# EAGLE design kulgurpowerproto (EAGLE 6.3)
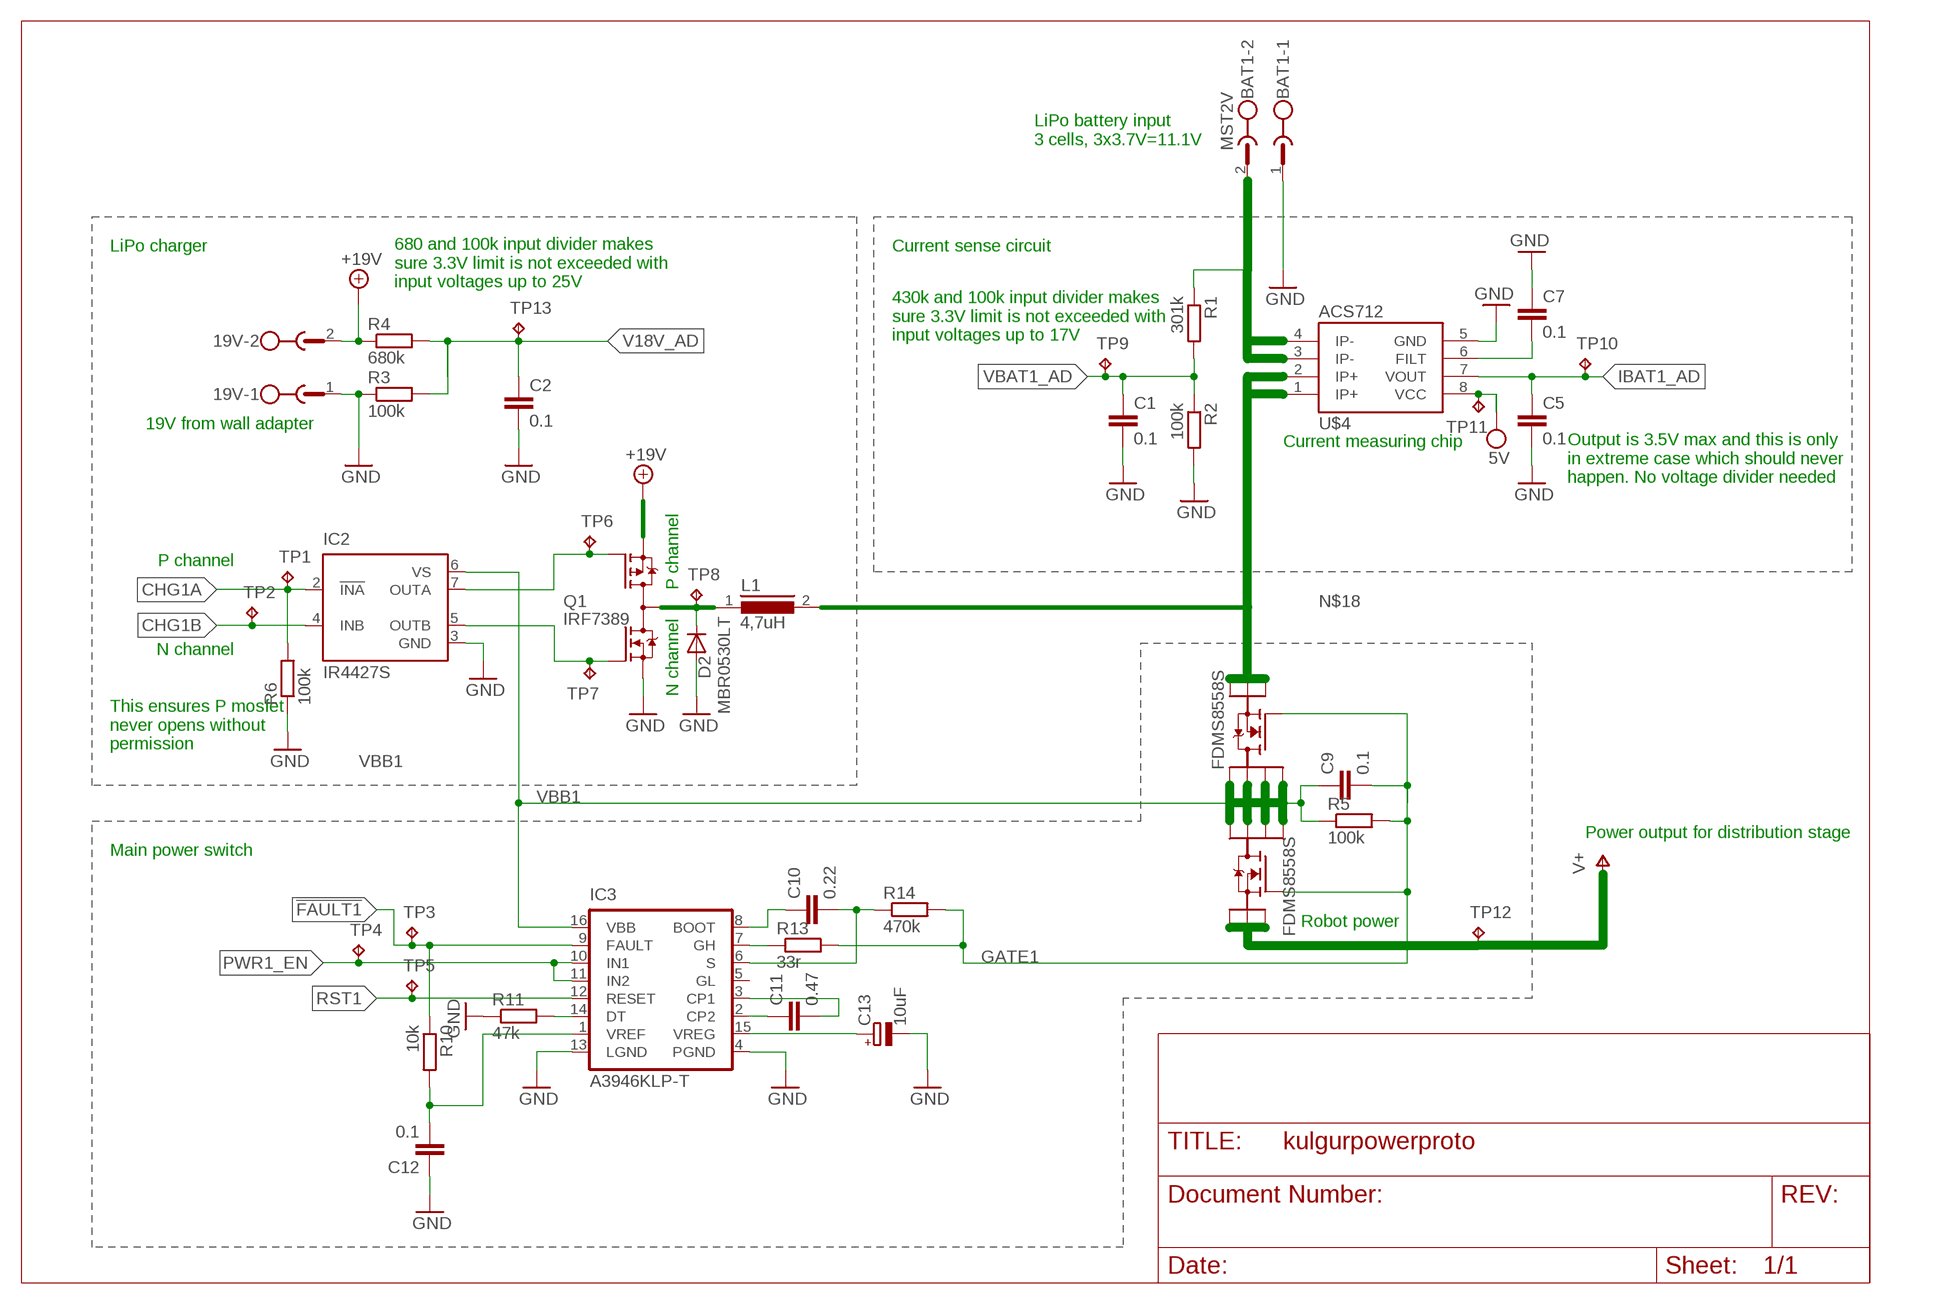
[diagram p0: schematic, sheet 1]

## Parts
19V  MST2V  [MSTBV2]
BAT1  MST2V  [MSTBV2]
C1  0.1  C-EUC0603  [C0603]
C2  0.1  C-EUC0603  [C0603]
C5  0.1  C-EUC0603  [C0603]
C7  0.1  C-EUC0603  [C0603]
C9  0.1  C-EUC0603  [C0603]
C10  0.22  C-EUC0603  [C0603]
C11  0.47  C-EUC0603  [C0603]
C12  0.1  C-EUC0603  [C0603]
C13  10uF  CPOL-EUA/3216-18R  [A/3216-18R]
D2  MBR0530LT  MBR0520LT  [SOD123]
IC2  IR4427S  IR4428S  [SO08]
IC3  A3946KLP-T  [TSSOP16E]
L1  4,7uH  DR73  [DR73]
Q1  IRF7389  [SO08-IRF]
R1  301k  R-EU_R0603  [R0603]
R2  100k  R-EU_R0603  [R0603]
R3  100k  R-EU_R0603  [R0603]
R4  680k  R-EU_R0603  [R0603]
R5  100k  R-EU_R0603  [R0603]
R6  100k  R-EU_R0603  [R0603]
R10  10k  R-EU_R0603  [R0603]
R11  47k  R-EU_R0603  [R0603]
R13  33r  R-EU_R0603  [R0603]
R14  470k  R-EU_R0603  [R0603]
TP1  TPB2,54  [B2,54]
TP2  TPB2,54  [B2,54]
TP3  TPB2,54  [B2,54]
TP4  TPB2,54  [B2,54]
TP5  TPB2,54  [B2,54]
TP6  TPB2,54  [B2,54]
TP7  TPB2,54  [B2,54]
TP8  TPB2,54  [B2,54]
TP9  TPB2,54  [B2,54]
TP10  TPB2,54  [B2,54]
TP11  TPB2,54  [B2,54]
TP12  TPB2,54  [B2,54]
TP13  TPB2,54  [B2,54]
U$2  FDMS8558S  [POWER56]
U$3  FDMS8558S  [POWER56]
U$4  ACS712  [SO08]

## Nets
5V [morepower]: TP11.TP U$4.8(VCC)
!FAULT1: IC3.9(FAULT) R10.1 TP3.TP
+19V [morepower]: 19V.2 Q1.3(P-S) R4.1
CHG1A: IC2.2(!INA) R6.2 TP1.TP
CHG1B: IC2.4(INB) TP2.TP
GATE1: C9.2 R5.2 R13.2 R14.2 U$2.P$4(G) U$3.P$4(G)
GND [morepower]: 19V.1 BAT1.1 C1.2 C2.2 C5.2 C7.1 C12.1 C13.- D2.A IC2.3(GND) IC3.4(PGND) IC3.13(LGND) Q1.1(N-S) R2.2 R3.1 R6.1 R11.1 U$4.5(GND)
IBAT1_AD: C5.1 TP10.TP U$4.7(VOUT)
N$1: IC2.7(OUTA) Q1.4(P-G) TP6.TP
N$3: IC2.5(OUTB) Q1.2(N-G) TP7.TP
N$15 [morepower]: D2.C L1.1 Q1.5(D) Q1.6(D) Q1.7(D) Q1.8(D) TP8.TP
N$17: C10.1 IC3.8(BOOT)
N$18 [morepower]: L1.2 U$2.P$1(S1) U$2.P$2(S2) U$2.P$3(S3) U$4.1(IP+) U$4.2(IP+)
N$20: C10.2 IC3.6(S) R14.1
N$21: C7.2 U$4.6(FILT)
N$24 [morepower]: BAT1.2 R1.1 U$4.3(IP-) U$4.4(IP-)
N$27: C11.1 IC3.2(CP2)
N$28: C11.2 IC3.3(CP1)
N$30: C12.2 IC3.1(VREF) R10.2
N$31: IC3.7(GH) R13.1
N$32: IC3.14(DT) R11.2
N$33: C13.+ IC3.15(VREG)
PWR1_EN: IC3.10(IN1) IC3.11(IN2) TP4.TP
RST1: IC3.12(RESET) TP5.TP
V18V_AD: C2.1 R3.2 R4.2 TP13.TP
V+ [morepower]: TP12.TP U$3.P$1(S1) U$3.P$2(S2) U$3.P$3(S3)
VBAT1_AD: C1.1 R1.2 R2.1 TP9.TP
VBB1 [morepower]: C9.1 IC2.6(VS) IC3.16(VBB) R5.1 U$2.P$5(D4) U$2.P$6(D3) U$2.P$7(D2) U$2.P$8(D1) U$3.P$5(D4) U$3.P$6(D3) U$3.P$7(D2) U$3.P$8(D1)
Unconnected: IC3.5(GL)

## Notes on the sheet
- LiPo battery input
  3 cells, 3x3.7V=11.1V
- LiPo charger | Current sense circuit
- 680 and 100k input divider makes
  sure 3.3V limit is not exceeded with 
  input voltages up to 25V
- 430k and 100k input divider makes
  sure 3.3V limit is not exceeded with 
  input voltages up to 17V
- 19V from wall adapter
- Current measuring chip
- Output is 3.5V max and this is only
  in extreme case which should never 
  happen. No voltage divider needed
- P channel
- P channel
- N channel
- N channel
- This ensures P mosfet
  never opens without 
  permission
- Power output for distribution stage
- Main power switch
- Robot power

## Library data of the parts
19V BAT1 = con-phoenix-508:MST2V: PHOENIX; OC_FARNELL: unknown; OC_NEWARK: unknown
C1 C2 C5 C7 = rcl:C-EU: CAPACITOR, European symbol
C9-C12 = resistor:C-EU: CAPACITOR, European symbol
C13 = resistor:CPOL-EU: POLARIZED CAPACITOR, European symbol
D2 = diode:MBR0520LT: SCHOTTKY BARRIER RECTIFIER Source: http://onsemi.com .. MBR0520LT1-D.pdf
IC2 = ir:IR4428: DUAL LOW SIDE DRIVER Source: ID4426.pdf; MF: INTERNATIONAL RECTIFIER(IR); MPN: IR4428STR; OC_FARNELL: 1023269; OC_NEWARK: 30C0206
IC3 = allegro:A3946: Half-Bridge Power MOSFET Controller Source: Data sheet <http://www.allegromicro.com/Products/Motor-Driver-And-Interface-ICs/Brushless-DC-Motor-Drivers/A3946.aspx>
L1 = inductors:DR73: High Power Density, High Efficiency, Shielded Inductors Source: coiltronics_dr_series.pdf
Q1 = transistor-fet:IRF7389: Complimentary Half Bridge HEXFET Power MOSFET Source: http://www.irf.com/product-info/datasheets/data/irf7389.pdf
R1-R6 R10 R11 R13 R14 = rcl:R-EU_: RESISTOR, European symbol
TP1-TP13 = testpad:TP: Test pad
U$2 U$3 = FDMS8558S:FDMS8558S
U$4 = SparkFun-AnalogIC:ACS712: Hall-effect-based isolated linear current sensor

## Net classes
0 default: width 0.4 mm, drill 0.5 mm, clearance 0.203 mm
1 power: width 1 mm, drill 0.5 mm, clearance 0.203 mm
2 morepower: width 2 mm, drill 1 mm, clearance 0.203 mm

## Board
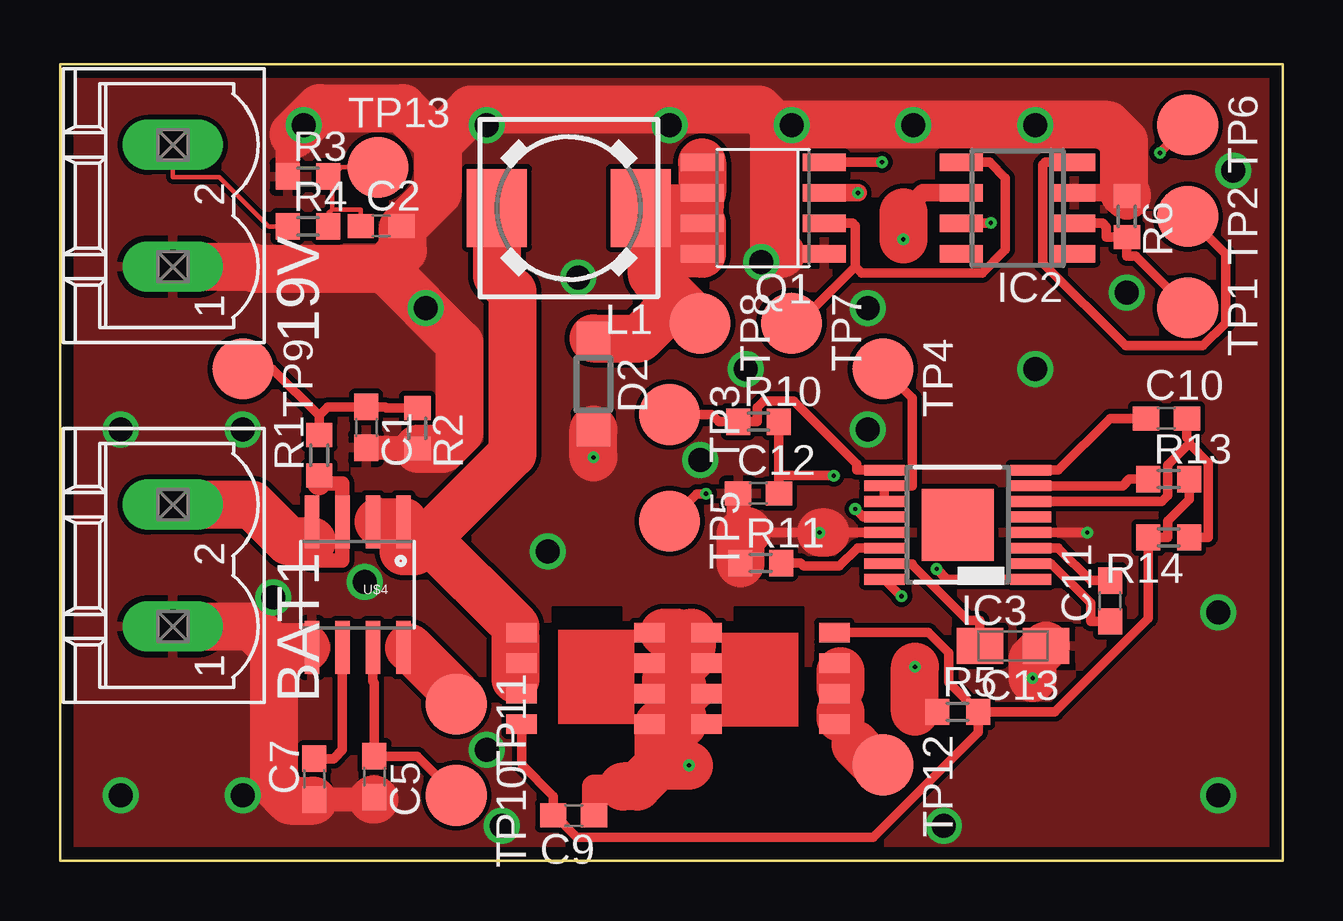
[diagram p1: board, top side]
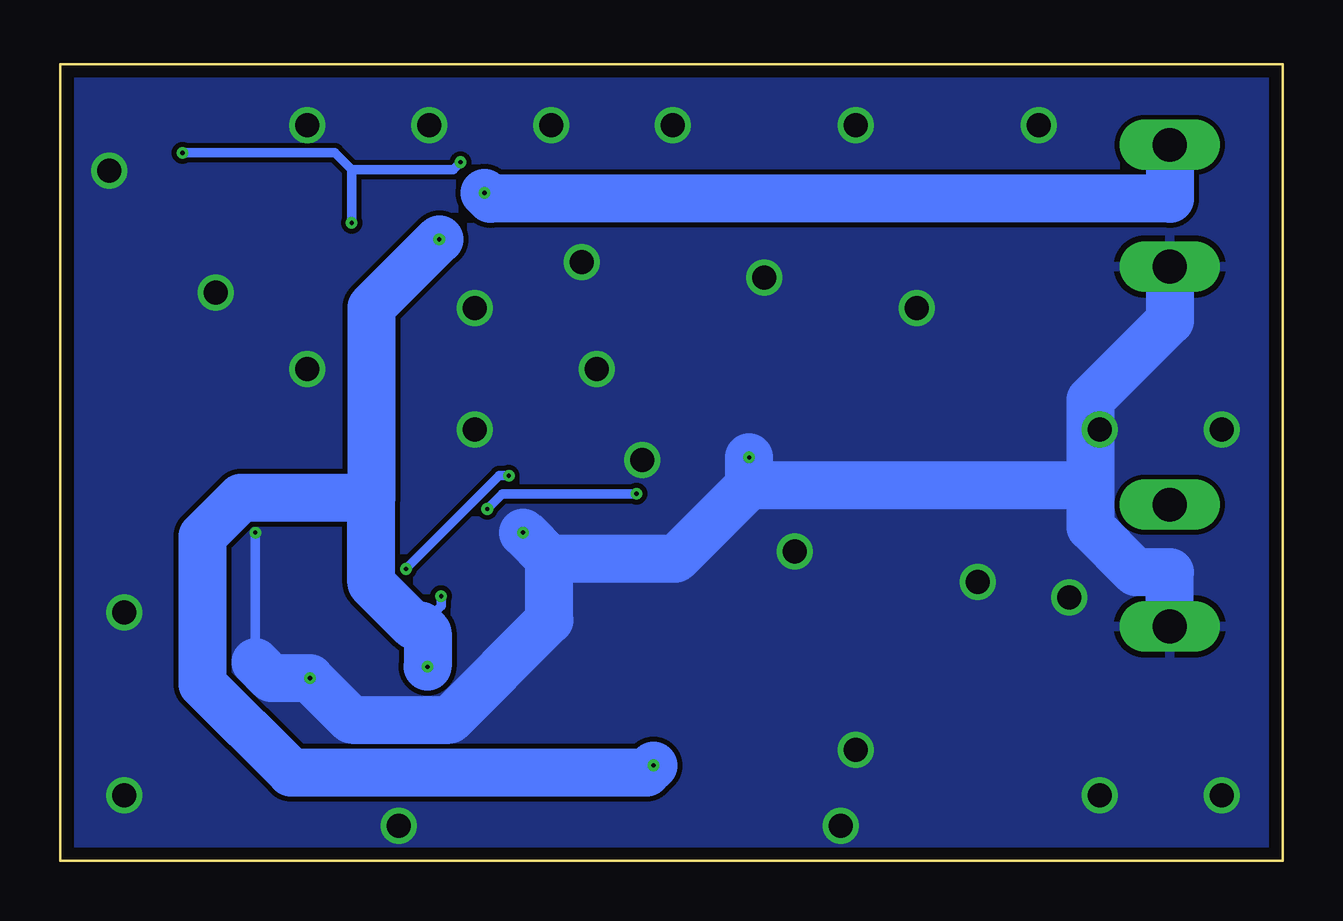
[diagram p2: board, bottom side, seen from below]

Size 50.94 x 33.2 mm. Coordinates in mm from the lower left corner, seen from the top.
Outline: 0,33.2 50.94,33.2 50.94,0 0,0 0,33.2
Copper layers (1*16): Top 0.035mm / dielectric 0.6mm / Bottom 0.035mm
Design rules "4mil_4lay2 *": minimum track width 4mil, minimum drill 7mil, track to track 4mil, track to pad 4mil, pad to pad 4mil, via to via 4mil, smd to smd 0mil, copper to edge 20mil, drill to drill 8mil, minimum pad ring 8mil, minimum via ring 6mil, stop-mask expansion 4mil, vias tented up to drill 18mil, thermal gap 10mil

### Footprints (pad centres in the part's own frame; a part is rotated, then mirrored left to right if it is on the bottom)
MSTBV2 = drill 1.397 long: 1 -2.54,0; 2 2.54,0
C0603 = smd 1.1 x 1: 1 -0.85,0; 2 0.85,0
A/3216-18R = smd 1.95 x 1.5: + 1.375,0; - -1.375,0
SOD123 = smd 1.4 x 1.4: A 1.9,0; C -1.9,0
SO08 = smd 0.72 x 1.78: 1 -1.905,-2.35; 2 -0.635,-2.35; 3 0.635,-2.35; 4 1.905,-2.35; 5 1.905,2.35; 6 0.635,2.35; 7 -0.635,2.35; 8 -1.905,2.35
TSSOP16E = smd 0.45 x 1.7: 1 -2.275,-3.05; 2 -1.625,-3.05; 3 -0.975,-3.05; 4 -0.325,-3.05; 5 0.325,-3.05; 6 0.975,-3.05; 7 1.625,-3.05; 8 2.275,-3.05; 9 2.275,3.05; 10 1.625,3.05; 11 0.975,3.05; 12 0.325,3.05; 13 -0.325,3.05; 14 -0.975,3.05; 15 -1.625,3.05; 16 -2.275,3.05 | smd 3 x 3: EXP 0,0
DR73 = smd 2.5 x 3.25: 1 -3,0; 2 3,0
SO08-IRF = smd 0.72 x 1.78: 1 -1.905,-2.543; 2 -0.635,-2.543; 3 0.635,-2.543; 4 1.905,-2.543; 5 1.905,2.543; 6 0.635,2.543; 7 -0.635,2.543; 8 -1.905,2.543
R0603 = smd 1 x 1.1: 1 -0.85,0; 2 0.85,0
B2,54 = smd 2.54 x 2.54: TP 0,0
POWER56 = smd 0.81 x 1.27: P$1 -1.905,-2.67; P$2 -0.635,-2.67; P$3 0.635,-2.67; P$4 1.905,-2.67; P$5 1.905,2.67; P$6 0.635,2.67; P$7 -0.635,2.67; P$8 -1.905,2.67
SO08' = smd 0.61 x 2.21: 1 -1.905,-2.616; 2 -0.635,-2.616; 3 0.635,-2.616; 4 1.905,-2.616; 5 1.905,2.616; 6 0.635,2.616; 7 -0.635,2.616; 8 -1.905,2.616

### Placement (x,y rotation side)
19V  4.7,27.3 90 top
BAT1  4.7,12.3 90 top
C1  12.76,18.06 270 top
C2  13.38,26.45 0 top
C5  13.1,3.5 270 top
C7  10.6,3.4 90 top
C9  21.4,1.88 180 top
C10  46.1,18.43 0 top
C11  43.75,10.82 90 top
C12  29.1,15.3 0 top
C13  39.71,8.95 180 top
D2  22.23,19.86 270 top
IC2  39.9,27.2 90 top
IC3  37.4,14 90 top
L1  21.2,27.2 180 top
Q1  29.3,27.2 90 top
R1  10.8,16.9 90 top
R2  14.89,18.02 270 top
R3  10.33,28.52 0 top
R4  10.33,26.44 0 top
R5  37.4,6.2 0 top
R6  44.45,26.85 270 top
R10  29.1,18.3 0 top
R11  29.2,12.4 0 top
R13  46.2,15.9 0 top
R14  46.2,13.47 180 top
TP1  46.99,23.04 270 top
TP2  46.99,26.85 270 top
TP3  25.4,18.59 270 top
TP4  34.29,20.5 270 top
TP5  25.4,14.15 270 top
TP6  46.99,30.66 270 top
TP7  30.48,22.41 270 top
TP8  26.67,22.41 270 top
TP9  7.62,20.5 270 top
TP10  16.51,2.72 270 top
TP11  16.51,6.53 270 top
TP12  34.29,3.99 270 top
TP13  13.26,28.9 0 top
U$2  21.9,7.6 270 top
U$3  29.6,7.6 90 top
U$4  ACS712  [SO08']  12.4,11.5 180 top

### Tracks (layer width: path | path; a pad name or v marks a point on that pad's centre or on a via)
5V
  Top 0.61: 14.54,8.88 U$4.8
  Top 2: 14.54,8.88 16.51,6.92 TP11.TP
!FAULT1
  Top 0.4: TP3.TP 27.15,18.59 27.45,18.3 R10.1 29.05,18.3 29.05,18.88 29.32,19.15 30.58,19.15 33.2,16.53 33.2,16.27 IC3.9
+19V  (via drill 0.18 pad 0.48)
  Top 0.178: R4.1 8.69,26.44 6.63,28.5 4.7,28.5 19V.2
  Top 0.72: Q1.3 v33.25,27.84
  Bottom 2: 19V.2 4.7,27.59 33.01,27.59 v33.25,27.84
CHG1A
  Top 0.4: IC2.2 43.44,26.57 43.6,26.41 43.6,26 R6.2 44.45,25.2 44.83,25.2 TP1.TP
CHG1B
  Top 0.4: IC2.4 41.06,29.11 40.96,29 40.96,24.9 44.4,21.46 47.61,21.46 48.56,22.41 48.56,25.27 TP2.TP
GATE1
  Top 0.4: U$3.P$4 36.18,9.5 37.03,8.66 37.03,7.42 R5.2 | R13.2 47.05,15.05 46.15,14.15 46.15,13.47 R14.2 45.35,10.09 41.45,6.19 39.06,6.19 39.05,6.2 R5.2 | R5.2 38.25,5.35 33.88,0.98 21.53,0.98 20.55,1.96 20.55,2.28 | 20.55,2.28 20.55,2.68 19.23,4 U$2.P$4 | C9.2 20.55,2.28
GND  (via drill 0.18 pad 0.48, 1)
  Top 0.4: IC3.4 v42.8,13.67 | IC3.13 31.9,13.67 | 31.7,13.67 v31.65,13.67 29.1,13.67
  Top 0.61: 10.26,8.88 U$4.5
  Top 0.72: 30.04,25.29 Q1.1 | IC2.3 43.7,27.84 44.34,27.84 44.34,28.18
  Top 1: 44.45,27.73 R6.1 | R3.1 9.48,29.77 9.73,30.02 9.73,30.27 | 14.91,17.16 R2.2 13.64,17.18 13.6,17.21 C1.2 | 14.29,26.39 C2.2 | 10.55,2.5 C7.1 13.05,2.55 | C12.1 28.25,14.1 | 28.25,14.1 | 28.25,14.1 28.62,13.73 | 13.1,2.55 C5.2 | 28.66,13.67 28.66,13.73 | 29.1,13.67 28.66,13.67 | 28.66,13.67 28.43,13.67 | R11.1
  Top 2: 29.75,30.67 29.75,25.59 30.04,25.29 | 44.34,28.18 44.34,29.97 43.65,30.67 29.75,30.67 | 29.75,30.67 29.11,31.31 17.13,31.31 15.73,29.91 | 44.34,27.84 44.45,27.73 | v22.23,16.8 D2.A | 15.73,29.91 15.73,27.84 14.29,26.39 14.29,25.45 13.52,24.68 | 9.73,30.27 10.83,31.38 14.27,31.38 15.73,29.91 | 13.52,24.68 16.64,21.56 16.64,17.87 15.93,17.16 14.91,17.16 | 13.52,24.68 8.08,24.68 8,24.76 19V.1 | 8.9,8.88 8.9,3.2 9.6,2.5 10.55,2.5 | 8.9,8.88 8.88,8.88 8,9.76 BAT1.1 | 10.26,8.88 8.9,8.88 | 28.66,13.73 28.62,13.73 | v40.53,7.6 40.53,8.4 C13.- | 13.1,2.55 13.05,2.55 | 31.9,13.67 31.7,13.67 | 28.43,13.67 28.35,13.6 R11.1
  Bottom 0.4: 42.8,8.27 v42.8,13.67
  Bottom 2: 8,15.64 8,19.21 4.7,22.51 19V.1 | 8,15.64 8,13.9 6.11,12.01 4.7,12.01 BAT1.1 | 8,15.64 22.23,15.64 | 22.23,15.64 v22.23,16.8 | 22.23,15.64 25.29,12.58 30.55,12.58 | 30.55,12.58 v31.65,13.67 | 30.55,12.58 30.55,10.03 34.71,5.87 38.8,5.87 v40.53,7.6 42.13,7.6 42.8,8.27
  other vias: 10.16,30.66 17.78,30.66 25.4,30.66 15.24,23.04 20.32,12.88 40.64,20.5 48.26,10.34 48.26,2.72 2.54,2.72 7.62,2.72 28.57,20.5 33.66,17.96 33.66,23.04 2.54,17.96 7.62,17.96 8.89,10.97 35.56,30.66 40.64,30.66 30.48,30.66 29.21,24.95 12.7,11.61 36.83,1.45 44.45,23.68 48.9,28.75 21.59,24.31 18.41,1.45 17.78,4.62 26.67,16.69
  pour Bottom: 0,33.2 0,0.18 50.8,0.18 50.8,33.2
  pour Top: 0,33.2 0,0.18 50.8,0.18 50.8,33.2
IBAT1_AD
  Top 0.4: U$4.7 13.04,7.48 13.1,7.41 C5.1 14.88,4.35 TP10.TP
N$1  (via drill 0.18 pad 0.48)
  Top 0.4: v38.79,26.58 38.77,26.57 38.74,26.57 IC2.7 | Q1.4 33.03,29.11 33.04,29.11 v34.25,29.11 | TP6.TP v45.83,29.5
  Bottom 0.4: 38.79,28.8 v38.79,26.58 | 38.79,28.8 39.48,29.5 v45.83,29.5 | v34.25,29.11 34.56,28.8 38.79,28.8
N$3
  Top 0.4: 33.14,24.76 33.4,24.49 38.43,24.49 39.39,25.46 39.39,28.45 38.74,29.11 IC2.5 | 33.14,24.76 33.14,26.46 33.03,26.57 Q1.2 | TP7.TP 30.78,22.41 33.14,24.76
N$15
  Top 2: 25.72,23.36 25.67,23.41 | 25.67,23.41 | 25.67,23.41 24.66,24.41 24.66,25.29 Q1.8 Q1.7 26.65,26.67 26.65,27.2 | TP8.TP 25.72,23.36 | 25.72,23.36 24.13,21.77 D2.C | 26.65,27.2 26.65,27.73 Q1.6 Q1.5 | L1.1 26.65,27.2
N$17
  Top 0.4: IC3.8 41.6,16.27 43.76,18.43 C10.1
N$18
  Top 0.61: 13.27,14.12 U$4.2
  Top 0.81: 18.98,9.75 U$2.P$1 18.99,9.26 | 18.99,7.55 19.23,7.31 U$2.P$3 | 18.99,8.11 18.99,7.99 | U$2.P$2 18.99,8.23
  Top 2: 15.31,13.42 14.78,12.89 14.3,12.89 U$4.1 13.27,14.12 | 15.31,13.42 18.85,16.96 18.85,23.72 18.2,24.37 L1.2 | 15.31,13.42 18.98,9.75 | 18.99,7.55 18.99,7.99 | 18.99,8.11 18.99,8.23 18.99,9.26
N$20
  Top 0.4: 47.05,17.38 47.05,17.52 46.95,17.63 C10.2 | IC3.6 45.9,14.97 46.15,15.22 46.15,16.48 47.05,17.38 | 47.05,17.38 47.85,16.58 47.85,13.47 R14.1
N$21
  Top 0.4: C7.2 11.4,4.25 11.77,4.61 U$4.6
N$24
  Top 0.61: U$4.4 10.49,13.31 10.49,12.5 11.77,12.5 U$4.3 11.77,15.73 10.8,15.73
  Top 1: R1.1 10.8,15.73
  Top 2: BAT1.2 8,14.84 9.53,13.31 10.49,13.31
N$27
  Top 0.4: C11.1 42.95,9.97 42.95,10.73 41.31,12.38 IC3.2
N$28
  Top 0.4: IC3.3 41.6,13.03 41.6,13.02 42.95,11.67 C11.2
N$30  (via drill 0.18 pad 0.48)
  Top 0.4: 29.95,16.05 C12.2 | R10.2 29.95,16.05 | 29.95,16.05 v32.24,16.05 | v36.53,12.16 36.96,11.72 IC3.1
  Bottom 0.4: v32.24,16.05 32.64,16.05 v36.53,12.16
N$31
  Top 0.4: R13.1 44.55,15.9 44.27,15.62 IC3.7
N$32
  Top 0.4: R11.2 30.85,12.4 30.98,12.27 32.48,12.27 33.23,13.03 IC3.14
N$33
  Top 0.4: C13.+ 38.33,10 37.82,10 35.5,12.32 35.5,12.38 IC3.15
PWR1_EN
  Top 0.4: IC3.11 IC3.10 35.5,15.62 35.5,19.29 TP4.TP
RST1  (via drill 0.18 pad 0.48)
  Top 0.4: TP5.TP 26.54,15.29 v26.92,15.29 | IC3.12 33.47,14.32 v33.14,14.66
  Bottom 0.4: v26.92,15.29 32.5,15.29 v33.14,14.66
V18V_AD
  Top 0.178: 11.34,28.52 11.72,28.9 TP13.TP | 11.34,28.52 R3.2 | 11.34,28.52 11.34,27.14 | 11.34,27.14 12.53,27.14 C2.1 | R4.2 11.18,26.98 11.34,27.14
V+
  Top 0.81: 32.51,7.21 U$3.P$2 32.51,6.72 32.51,6.19 | 32.51,7.9 32.27,8.14 U$3.P$3 | 32.51,5.94 U$3.P$1 33.14,4.83
  Top 2: 32.51,7.9 32.51,7.21 | 32.51,6.19 32.51,5.94 | TP12.TP 33.98,3.99 33.14,4.83
VBAT1_AD
  Top 0.4: TP9.TP 8.85,20.5 10.8,18.55 | 10.8,18.55 11.16,18.91 12.06,18.91 C1.1 13.56,18.91 13.6,18.88 R2.1 | R1.2 10.8,18.55
VBB1  (via drill 0.18 pad 0.48)
  Top 0.4: IC3.16 v35.06,11.02
  Top 0.72: 35.14,27.03 35.95,27.84 IC2.6
  Top 0.81: 26.32,8.85 U$3.P$6 25.94,7.25 | U$3.P$5 26.32,9.5 25.7,9.5 | 25.26,7.55 U$2.P$7 | U$2.P$6 25.26,6.96 25.94,6.96 U$3.P$7 25.94,5.98 | U$3.P$8 25.94,5.69 24.93,5.69 U$2.P$5 | U$2.P$8 25.18,9.5
  Top 1: C9.1 22.25,3.08 23.45,3.08 23.46,3.09 | 35.62,6.2 R5.1
  Top 2: 35.14,27.03 v35.14,25.9 | 35.62,6.2 v35.62,8.08 | 26.32,9.5 26.32,8.85 | 25.26,6.96 25.26,7.55 | 25.94,6.96 25.94,7.25 | 25.94,5.69 25.94,5.98 | 25.18,9.5 25.7,9.5 | 24.93,5.69 24.93,3.97 | 24.93,3.97 24.06,3.09 23.46,3.09 | 24.93,3.97 v26.21,3.97
  Bottom 0.4: v35.06,11.02 35.06,10.62 35.48,10.2 35.89,9.78
  Bottom 2: 37.97,15.12 43.4,15.12 45.01,13.52 45.01,7.36 41.31,3.67 26.51,3.67 v26.21,3.97 | v35.14,25.9 37.97,23.06 37.97,15.12 | 37.97,15.12 37.97,11.56 36.2,9.78 35.89,9.78 35.62,9.51 v35.62,8.08